# Altium schematic sheet RFmodule.SchDoc
size A
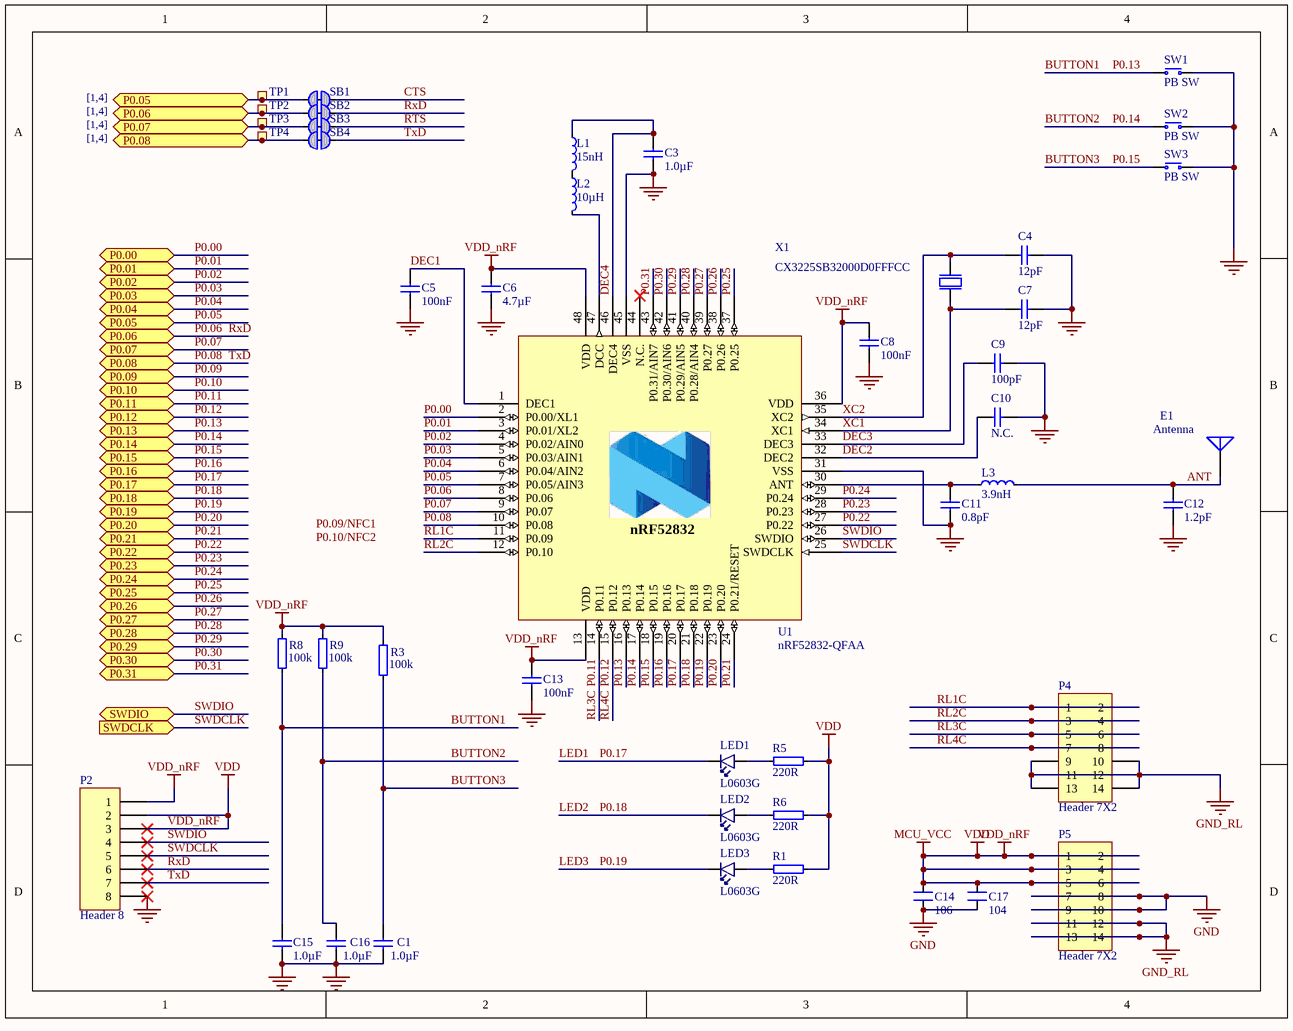
[diagram p0: RFmodule.SchDoc]

## Parts
C1  1.0µF  [CAPC1608X06L]
C3  1.0µF  [CAPC1608X06L]
C4  12pF  [CAPC1608X06L]
C5  100nF  [CAPC1608X06L]
C6  4.7µF  [CAPC1608X06L]
C7  12pF  [CAPC1608X06L]
C8  100nF  [CAPC1608X06L]
C9  100pF  [CAPC1608X06L]
C10  N.C.  [CAPC1608X06L]
C11  0.8pF  [CAPC1608X06L]
C12  1.2pF  [CAPC1608X06L]
C13  100nF  [CAPC1608X06L]
C14  106  [0805_HV]
C15  1.0µF  [CAPC1608X06L]
C16  1.0µF  [CAPC1608X06L]
C17  104  [0805_HV]
E1  Antenna  [nrfant]
L1  15nH  [0603]
L2  10µH  [0603]
L3  3.9nH  [0603]
LED1  L0603G  [LED_0603_G]
LED2  L0603G  [LED_0603_G]
LED3  L0603G  [LED_0603_G]
P2  Header 8  [HDR1X8]
P4  Header 7X2  [CON14_1.27]
P5  Header 7X2  [CON14_1.27]
R1  220R  [0603]
R3  100k  [0603]
R5  220R  [0603]
R6  220R  [0603]
R8  100k  [0603]
R9  100k  [0603]
SB1  Solderbridge  [Solderbridge_Shorted]  (value not drawn)  (net tie, no BOM)
SB2  Solderbridge  [Solderbridge_Shorted]  (value not drawn)  (net tie, no BOM)
SB3  Solderbridge  [Solderbridge_Shorted]  (value not drawn)  (net tie, no BOM)
SB4  Solderbridge  [Solderbridge_Shorted]  (value not drawn)  (net tie, no BOM)
SW1  PB SW  [KSC521J]
SW2  PB SW  [KSC521J]
SW3  PB SW  [KSC521J]
TP1  Ø1.0mm,SMD  [TP_SMD_Ø1.0mm]  (value not drawn)  (no BOM)
TP2  Ø1.0mm,SMD  [TP_SMD_Ø1.0mm]  (value not drawn)  (no BOM)
TP3  Ø1.0mm,SMD  [TP_SMD_Ø1.0mm]  (value not drawn)  (no BOM)
TP4  Ø1.0mm,SMD  [TP_SMD_Ø1.0mm]  (value not drawn)  (no BOM)
U1  nRF52832-QFAA  [QFN40P600X600X90-48N]
X1  CX3225SB32000D0FFFCC  [SON230P260X60-4N]

## Ports
P0.00 (bidir), P0.01 (bidir), P0.02 (bidir), P0.03 (bidir), P0.04 (bidir), P0.05 (bidir), P0.06 (bidir), P0.07 (bidir), P0.08 (bidir), P0.09 (bidir), P0.10 (bidir), P0.11 (bidir), P0.12 (bidir), P0.13 (bidir), P0.14 (bidir), P0.15 (bidir), P0.16 (bidir), P0.17 (bidir), P0.18 (bidir), P0.19 (bidir), P0.20 (bidir), P0.21 (bidir), P0.22 (bidir), P0.23 (bidir), P0.24 (bidir), P0.25 (bidir), P0.26 (bidir), P0.27 (bidir), P0.28 (bidir), P0.29 (bidir), P0.30 (bidir), P0.31 (bidir), SWDCLK (in), SWDIO (bidir)

## Nets
GND: C1.1 C3.1 C4.2 C5.2 C6.2 C7.2 C8.2 C9.2 C10.2 C11.1 C12.2 C13.2 C14.1 C15.2 C16.1 C17.1 P2.8 P5.7 P5.8 P5.9 P5.10 SW1.1(N.O) SW2.1(N.O) SW3.1(N.O) U1.31(VSS) U1.45(VSS) U1.49(GND) X1.2(GND) X1.4(GND)
GND_RL: P4.9 P4.10 P4.11 P4.12 P4.13 P4.14 P5.11 P5.12 P5.13 P5.14
VDD_nRF: C6.1 C8.1 C13.1 C14.2 C17.2 P2.1 P2.2 P2.3 P5.1 P5.2 P5.3 P5.4 P5.5 P5.6 R1.2 R3.2 R5.2 R6.2 R8.2 R9.2 U1.13(VDD) U1.36(VDD) U1.48(VDD)  [also labelled MCU_VCC, VDD]
ANT: C12.1 E1.1(A) L3.2
BUTTON1: C15.1 R8.1 SW1.2(COM) U1.16(P0.13) ; port P0.13  [also labelled P0.13]
BUTTON2: C16.2 R9.1 SW2.2(COM) U1.17(P0.14) ; port P0.14  [also labelled P0.14]
BUTTON3: C1.2 R3.1 SW3.2(COM) U1.18(P0.15) ; port P0.15  [also labelled P0.15]
CTS: SB1.2
DEC1: C5.1 U1.1(DEC1)
DEC2: C10.1 U1.32(DEC2)
DEC3: C9.1 U1.33(DEC3)
DEC4: C3.2 L1.1 U1.46(DEC4)
LED1: LED1.1(C) U1.20(P0.17) ; port P0.17  [also labelled P0.17]
LED2: LED2.1(C) U1.21(P0.18) ; port P0.18  [also labelled P0.18]
LED3: LED3.1(C) U1.22(P0.19) ; port P0.19  [also labelled P0.19]
P0.00: U1.2(P0.00/XL1) ; port P0.00
P0.01: U1.3(P0.01/XL2) ; port P0.01
P0.02: U1.4(P0.02/AIN0) ; port P0.02
P0.03: U1.5(P0.03/AIN1) ; port P0.03
P0.04: U1.6(P0.04/AIN2) ; port P0.04
P0.05: SB1.1 TP1.1 U1.7(P0.05/AIN3) ; port P0.05
P0.06: P2.6 SB2.1 SB2.2 TP2.1 U1.8(P0.06) ; port P0.06  [also labelled RxD]
P0.07: SB3.1 TP3.1 U1.9(P0.07) ; port P0.07
P0.08: P2.7 SB4.1 SB4.2 TP4.1 U1.10(P0.08) ; port P0.08  [also labelled TxD]
P0.09: port P0.09
P0.10: port P0.10
P0.11: P4.5 P4.6 U1.14(P0.11) ; port P0.11  [also labelled RL3C]
P0.12: P4.7 P4.8 U1.15(P0.12) ; port P0.12  [also labelled RL4C]
P0.16: U1.19(P0.16) ; port P0.16
P0.20: U1.23(P0.20) ; port P0.20
P0.21: U1.24(P0.21/RESET) ; port P0.21
P0.22: U1.27(P0.22) ; port P0.22
P0.23: U1.28(P0.23) ; port P0.23
P0.24: U1.29(P0.24) ; port P0.24
P0.25: U1.37(P0.25) ; port P0.25
P0.26: U1.38(P0.26) ; port P0.26
P0.27: U1.39(P0.27) ; port P0.27
P0.28: U1.40(P0.28/AIN4) ; port P0.28
P0.29: U1.41(P0.29/AIN5) ; port P0.29
P0.30: U1.42(P0.30/AIN6) ; port P0.30
P0.31: U1.43(P0.31/AIN7) ; port P0.31
RL1C: P4.1 P4.2 U1.11(P0.09)
RL2C: P4.3 P4.4 U1.12(P0.10)
RTS: SB3.2
SWDCLK: P2.5 U1.25(SWDCLK) ; port SWDCLK
SWDIO: P2.4 U1.26(SWDIO) ; port SWDIO
XC1: C7.1 U1.34(XC1) X1.1(inp)
XC2: C4.1 U1.35(XC2) X1.3(out)
NetC11_2: C11.2 L3.1 U1.30(ANT)
NetL1_2: L1.2 L2.1
NetL2_2: L2.2 U1.47(DCC)
NetLED1_2: LED1.2(A) R5.1
NetLED2_2: LED2.2(A) R6.1
NetLED3_2: LED3.2(A) R1.1

Not connected (* = marked no-connect by the designer): U1 44(N.C.)*

## Notes on the sheet
- [1,4]
- Labels drawn without touching a wire or pin: P0.09/NFC1, P0.10/NFC2
- (in symbol nRF52832-QFAA) nRF52832

## Library data of the parts
C1 C15 C16 = C0402-1µ0: Capacitor, X5R, ±5%; Note: 6.3V; Artikkelnr Noca: 20039235; Artikkelnr Simpro: N.A.; Part Number: C0402-1µ0; Manufacturer: *; Manufacturer Part Number: *; Datasheet: *; Footprint Doc: 0402; LatestRevisionDate: 2009-11-23; Pin Count: 2; Publisher: Nordic Semiconductor; Published: 2009-05-08; Value: 1.0µF; Supplier: *; Supplier part number: *; 2nd source Supplier: *; 2nd source part number: *
C3 = C0603-1µ0: Capacitor, X7R, ±10%; Note: 16V; Artikkelnr Noca: 20039335; Artikkelnr Simpro: N.A.; Part Number: C0603-1µ0; Manufacturer: *; Manufacturer Part Number: *; Datasheet: *; LatestRevisionDate: 2013-06-05; Pin Count: 2; Publisher: Nordic Semiconductor; Published: 2009-05-08; Value: 1.0µF; Supplier: *; Supplier part number: *; 2nd source Supplier: *; 2nd source part number: *; Footprint Doc: 0603
C4 C7 = C0402-12p: Capacitor, NP0, ±2%; Note: 50V; Artikkelnr Noca: 20029159; Artikkelnr Simpro: N.A.; Part Number: C0402-12p; Manufacturer: *; Manufacturer Part Number: *; Datasheet: *; LatestRevisionDate: 2011-05-11; Pin Count: 2; Publisher: Nordic Semiconductor; Published: 2009-05-08; Value: 12pF; Supplier: *; Supplier part number: *; 2nd source Supplier: *; 2nd source part number: *; Footprint Doc: 0402
C5 C8 C13 = C0402-100n: Capacitor, X7R, ±10%; Note: 16V; Artikkelnr Noca: 20039200; Artikkelnr Simpro: N.A.; Part Number: C0402-100n; Manufacturer: *; Manufacturer Part Number: *; Datasheet: *; LatestRevisionDate: 2009-11-23; Pin Count: 2; Publisher: Nordic Semiconductor; Published: 2009-05-08; Value: 100nF; Supplier: *; Supplier part number: *; 2nd source Supplier: *; 2nd source part number: *; Footprint Doc: 0402
C6 = C0603-4µ7: Capacitor, X5R, ±10%; Note: 6.3V; Artikkelnr Noca: 20069060; Artikkelnr Simpro: N.A.; Part Number: C0603-4µ7; Manufacturer: *; Manufacturer Part Number: *; Datasheet: *; LatestRevisionDate: 2009-11-23; Pin Count: 2; Publisher: Nordic Semiconductor; Published: 2009-05-08; Value: 4.7µF; Supplier: *; Supplier part number: *; 2nd source Supplier: *; 2nd source part number: *; Footprint Doc: 0603
C9 = C0402-100p: Capacitor, NP0, ±5%; Note: 50V; Artikkelnr Noca: 20029135; Artikkelnr Simpro: N.A.; Part Number: C0402-100p; Manufacturer: *; Manufacturer Part Number: *; Datasheet: *; LatestRevisionDate: 2009-05-08; Pin Count: 2; Publisher: Nordic Semiconductor; Published: 2009-05-08; Value: 100pF; Supplier: *; Supplier part number: *; 2nd source Supplier: *; 2nd source part number: *; Footprint Doc: 0402
C10 = C0402-N.C.: Not mounted; Note: Chip Cap; Artikkelnr Noca: N.A.; Part Number: C0402-N.C.; Manufacturer: *; Manufacturer Part Number: *; Datasheet: *; Footprint Doc: 0402; LatestRevisionDate: 2009-05-08; Pin Count: 2; Publisher: Nordic Semiconductor; Published: 2009-05-08; Value: N.C.; Supplier: *; Supplier part number: *; 2nd source Supplier: *; 2nd source part number: *; Artikkelnr Simpro: N.A.
C11 = C0402-0.8p: Capacitor, NP0, ±5%; Note: 50V; Artikkelnr Noca: 20029147; Artikkelnr Simpro: N.A.; Part Number: C0402-0.8p; Manufacturer: *; Manufacturer Part Number: *; Datasheet: *; LatestRevisionDate: 2012-11-21; Pin Count: 2; Publisher: Nordic Semiconductor; Published: 2009-05-08; Value: 0.8pF; Supplier: *; Supplier part number: *; 2nd source Supplier: *; 2nd source part number: *; Footprint Doc: 0402
C12 = C0402-1.2p: Capacitor, NP0, ±0.1pF; Note: 50V; Artikkelnr Noca: 20029157; Artikkelnr Simpro: N.A.; Part Number: C0402-1.2p; Manufacturer: *; Manufacturer Part Number: *; Datasheet: *; LatestRevisionDate: 2011-05-11; Pin Count: 2; Publisher: Nordic Semiconductor; Published: 2009-05-08; Value: 1.2pF; Supplier: *; Supplier part number: *; 2nd source Supplier: *; 2nd source part number: *; Footprint Doc: 0402
C14 C17 = CM: Cap SMD; Value: 103
E1 = Antenna: Generic Antenna; Published: 24-Mar-1999; LatestRevisionDate: 17-Jul-2002; LatestRevisionNote: Re-released for DXP Platform.; PackageReference: PIN1; Publisher: Altium Limited
L1 = L0402-15n: Inductor, 320mA, ±5%; Manufacturer: Taiyo Yuden; Manufacturer Part Number: HK100515NJ-T; 2nd source part number: 658-1328; Note: High frequency chip inductor ±10%; Artikkelnr Noca: 33029323; Artikkelnr Simpro: N.A.; Part Number: L0402-15n; LatestRevisionDate: 2012-09-19; Pin Count: 2; Publisher: Nordic Semiconductor; Published: 2010-07-12; Value: 15nH; Supplier: Digi-Key; Datasheet: http://www.yuden.co.jp/productdata/catalog/en/mlci04_e.pdf; Supplier part number: 587-1521-1-ND; 2nd source Supplier: Farnell; Footprint Doc: 0402
L2 = L0603-10µ: Inductor, 80mA, ±10%; Manufacturer: Taiyo Yuden; Manufacturer Part Number: LBMF1608T100K; 2nd source part number: 178-6105; Note: LBMF1608T100K 10µH 80mA 0603; Artikkelnr Noca: 33029314; Artikkelnr Simpro: N.A.; Part Number: L0603-10µ; Datasheet: http://www.yuden.co.jp/ut/product/pdf/elb2_e.pdf; LatestRevisionDate: 2012-09-19; Pin Count: 2; Publisher: Nordic Semiconductor; Published: 2010-02-24; Value: 10µH; Supplier: Digi-Key; Supplier part number: 587-1714-1-ND; 2nd source Supplier: Farnell; Footprint Doc: 0603
L3 = L0402-3n9: Inductor, 170mA, ±0.1nH; Manufacturer: Murata; Manufacturer Part Number: LQP15MN3N9B02D; Note: High frequency chip inductor ±5%; Artikkelnr Noca: 33029151; Artikkelnr Simpro: N.A.; Part Number: L0402-3n9; Datasheet: http://search.murata.co.jp/Ceramy/image/img/PDF/ENG/L0075S0084LQP15M.pdf; LatestRevisionDate: 2012-09-19; Pin Count: 2; Publisher: Nordic Semiconductor; Published: 2009-05-08; Value: 3.9nH; Supplier: Digi-Key; Supplier part number: 490-1131-1-ND; 2nd source Supplier: *; 2nd source part number: *; Footprint Doc: 0402
LED1-LED3 = LG L29K Smartled Green: LED SMARTLED GREEN 570NM 0603; Manufacturer: Multicomp; Manufacturer Part Number: LG L29K-G2J1-24-Z; Note: 2,24..5.6 mcd, Vfmin=1.7V; Artikkelnr Noca: N.A.; Part Number: LG L29K Smartled Green; Datasheet: http://www.osram-os.com/Graphics/XPic2/00077107_0.pdf; Footprint Doc: 0603; LatestRevisionDate: 2014-10-28; Pin Count: 2; Publisher: Nordic Semiconductor; Published: 2014-10-28; Value: L0603G; Supplier: Digi-Key; Supplier part number: 475-2709-1-ND; 2nd source Supplier: *; 2nd source part number: *; Artikkelnr Simpro: N.A.
P2 = Header 8: Header, 8-Pin; LatestRevisionDate: 17-Jul-2002; LatestRevisionNote: Re-released for DXP Platform.; Publisher: Altium Limited
P4 P5 = Header 7X2: Header, 7-Pin, Dual row; LatestRevisionDate: 17-Jul-2002; LatestRevisionNote: Re-released for DXP Platform.; Publisher: Altium Limited
R1 R5 R6 = R0402-220: Resistor, ±1%, 0.063W; Note: Chip Res 1%; Artikkelnr Noca: 27049057; Artikkelnr Simpro: N.A.; Part Number: R0402-220; Manufacturer: *; Manufacturer Part Number: *; Datasheet: *; LatestRevisionDate: 2009-11-23; Pin Count: 2; Publisher: Nordic Semiconductor; Published: 2009-05-08; Value: 220R; Supplier: Farnell; Supplier part number: 173-8841; 2nd source Supplier: *; 2nd source part number: *; Footprint Doc: 0402
R3 R8 R9 = R0402-100k: Resistor, ±1%, 0.063W; Note: Chip Res 1%; Artikkelnr Noca: 27049121; Artikkelnr Simpro: N.A.; Part Number: R0402-100k; Manufacturer: *; Manufacturer Part Number: *; Datasheet: *; Footprint Doc: 0402; LatestRevisionDate: 2009-11-23; Pin Count: 2; Publisher: Nordic Semiconductor; Published: 2009-05-08; Value: 100k; Supplier: Farnell; Supplier part number: 173-8877; 2nd source Supplier: *; 2nd source part number: *
SB1-SB4 = Solderbridge Shorted: Shorted Solderbridge; Artikkelnr Noca: N.A.; Part Number: Solderbridge Shorted; Manufacturer: *; Manufacturer Part Number: *; Datasheet: *; LatestRevisionDate: 2012-08-07; Pin Count: 2; Publisher: Nordic Semiconductor; Published: 2012-08-07; Value: Solderbridge; Note: *; Supplier: *; Supplier part number: *; 2nd source Supplier: *; 2nd source part number: *; Footprint Doc: Solderbridge_Shorted; Artikkelnr Simpro: N.A.
SW1-SW3 = Switch-PB-6.2x6.3mm-SMD: Tactile Switch, SPNO, SMD, 160gf, 6.2x6.3x2.5mm; Manufacturer: Dailywell; Manufacturer Part Number: TS604VM1-025BR-R; 2nd source part number: 688-SKHUALE010; Artikkelnr Noca: 50019106; Artikkelnr Simpro: N.A.; Part Number: Switch-PB-6.2x6.3mm-SMD; Datasheet: \\hizz\pro\app9717\Datasheet\switches\Daliywell\TS604VM1-025BR-R.pdf; Footprint Doc: Switch-PB-6.2x6.3mm-SMD; LatestRevisionDate: 2016-04-21; Pin Count: 4; Publisher: Nordic Semiconductor; Published: 2010-02-01; Value: PB SW; Note: *; Supplier: Cabcon; Supplier part number: TS604VM1-025BR-R; 2nd source Supplier: Mouser
TP1-TP4 = TP_SMD_Ø1.0MM: 1.0mm circular SMD testpad; Manufacturer: Nordic Semiconductor; Artikkelnr Noca: N.A.; Part Number: TP_SMD_Ø1.0MM; Manufacturer Part Number: *; Datasheet: *; LatestRevisionDate: 2013-06-11; Pin Count: 1; Publisher: Nordic Semiconductor; Published: 2013-06-11; Value: Ø1.0mm,SMD; Note: *; Supplier: *; Supplier part number: *; 2nd source Supplier: *; 2nd source part number: *; Footprint Doc: TP_SMD_Ø1.0mm; Artikkelnr Simpro: N.A.
U1 = nRF52832-QFAA: Multi-protocol Bluetooth Low Energy and 2.4GHz proprietary system-on-chip; Manufacturer: Nordic Semiconductor; Artikkelnr Noca: N.A.; Part Number: nRF52832-QFAA; Manufacturer Part Number: nRF52832-QFAA; Datasheet: *; LatestRevisionDate: 2014-11-26; Pin Count: 48; Publisher: Nordic Semiconductor; Published: 2014-11-26; Value: nRF52832-QFAA; Note: *; Supplier: Nordic Semiconductor; Supplier part number: *; 2nd source Supplier: *; 2nd source part number: *; Footprint Doc: QFN-48; Artikkelnr Simpro: N.A.
X1 = XTAL_SMD2016_32MHz_8pF_Epson: XTAL SMD 2016, 32MHz, Cl=8pF, Tol: ±10ppm, Stab: ±10ppm; Manufacturer: Epson Toyocom; Manufacturer Part Number: Q22FA12800025; Note: XTAL SMD 32.000MHz; Artikkelnr Noca: N.A.; Part Number: CX3225SB32000D0FFFCC; Datasheet: http://www.epsondevice.com/docs/qd/en/DownloadServlet?id=ID000449; LatestRevisionDate: 2014-11-27; Pin Count: 4; Publisher: Nordic Semiconductor; Published: 2012-03-09; Value: 32MHz; Supplier: Farnell; Supplier part number: 171-2806; 2nd source Supplier: *; 2nd source part number: *; Footprint Doc: XTAL_2016; Artikkelnr Simpro: N.A.